# EAGLE design VotronicSRDuoDig_connector (EAGLE 7.6.0)
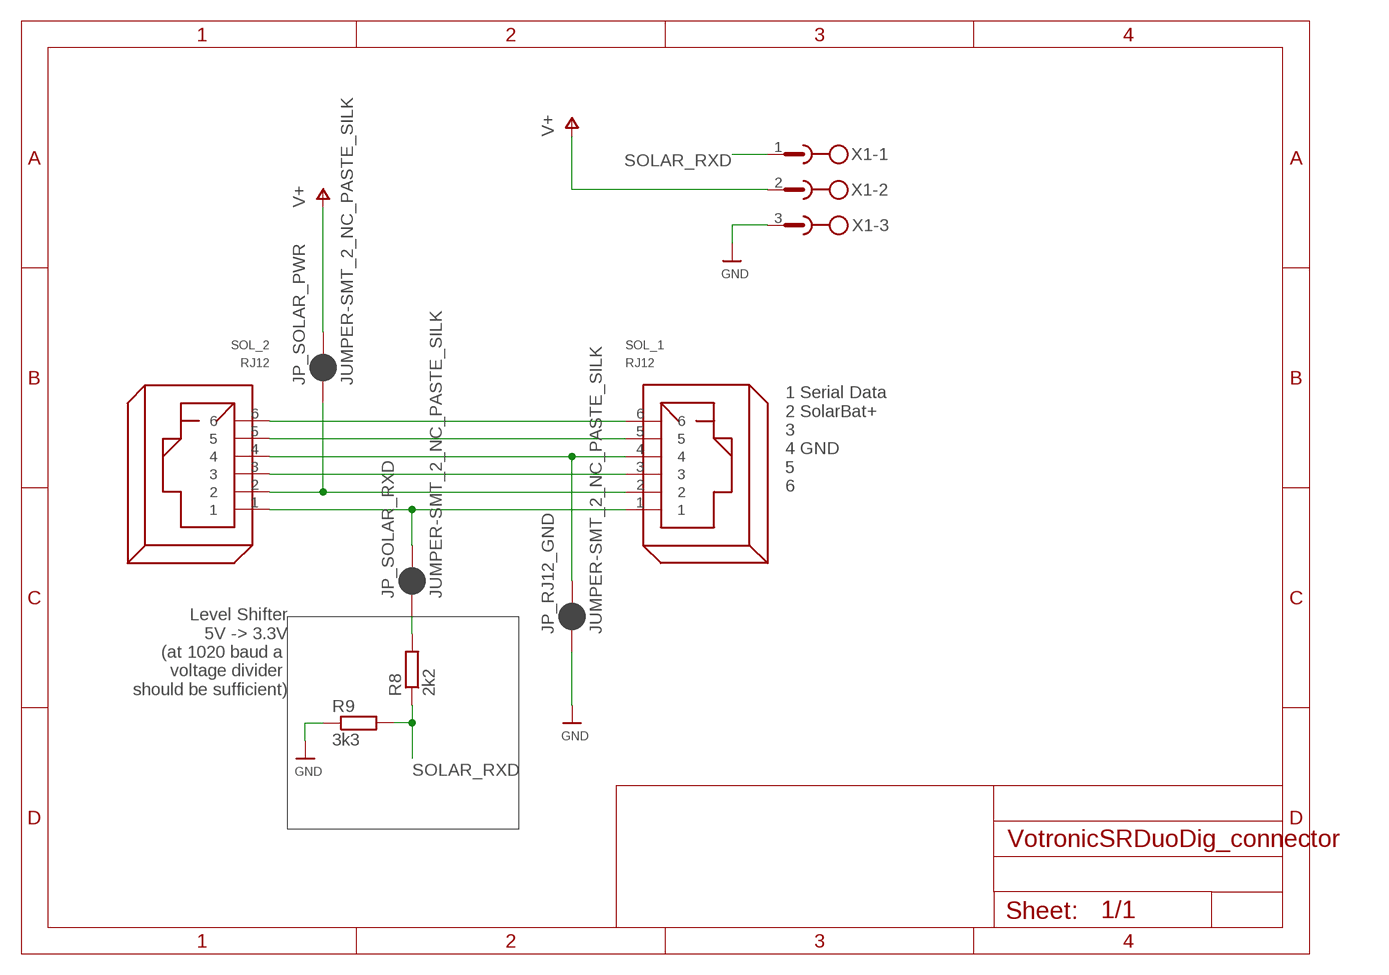
[diagram p0: schematic, sheet 1]

## Parts
JP_RJ12_GND  JUMPER-SMT_2_NC_PASTE_SILK  [SMT-JUMPER_2_NC_PASTE_SILK]
JP_SOLAR_PWR  JUMPER-SMT_2_NC_PASTE_SILK  [SMT-JUMPER_2_NC_PASTE_SILK]
JP_SOLAR_RXD  JUMPER-SMT_2_NC_PASTE_SILK  [SMT-JUMPER_2_NC_PASTE_SILK]
R8  2k2  R-EU_R0805  [R0805]
R9  3k3  R-EU_R0805  [R0805]
SOL_1  RJ12  [RJ12]
SOL_2  RJ12  [RJ12]
X1  W232-3  [W232-3]

## Nets
GND [power]: JP_RJ12_GND.1 R9.1 X1.3
N$1: JP_SOLAR_RXD.1 R8.2
N$2: SOL_1.3 SOL_2.3
N$3 [power]: JP_SOLAR_PWR.1 SOL_1.2 SOL_2.2
N$4: JP_SOLAR_RXD.2 SOL_1.1 SOL_2.1
N$5: SOL_1.5 SOL_2.5
N$6: SOL_1.6 SOL_2.6
SOLAR_GND [power]: JP_RJ12_GND.2 SOL_1.4 SOL_2.4
SOLAR_RXD: R8.1 R9.2 X1.1
V+ [power]: JP_SOLAR_PWR.2 X1.2

## Notes on the sheet
- 1 Serial Data
  2 SolarBat+
  3
  4 GND
  5 
  6
- Level Shifter
  5V -> 3.3V
  (at 1020 baud a 
  voltage divider 
  should be sufficient)

## Library data of the parts
JP_RJ12_GND JP_SOLAR_PWR JP_SOLAR_RXD = SparkFun-Jumpers:JUMPER-SMT_2_NC_PASTE: Normally closed solder jumper This jumper has an aperture in the stencil to allow solder paste to bridge the split in the wire so it's normally closed (NC). Wick off the solder to open the connection. Reapply solder to reclose the connection.
R8 R9 = rcl:R-EU_: RESISTOR, European symbol
SOL_1 SOL_2 = con-rj:RJ12: RJ12, RJ14 and RJ25 RJ12, RJ14 and RJ25 jacks side mounted http://www.tycoelectronics.com
X1 = con-wago-508:W232-3: WAGO SREW CLAMP; OC_FARNELL: unknown; OC_NEWARK: unknown

## Net classes
1 power: width 0.508 mm, clearance 0.102 mm

## Board
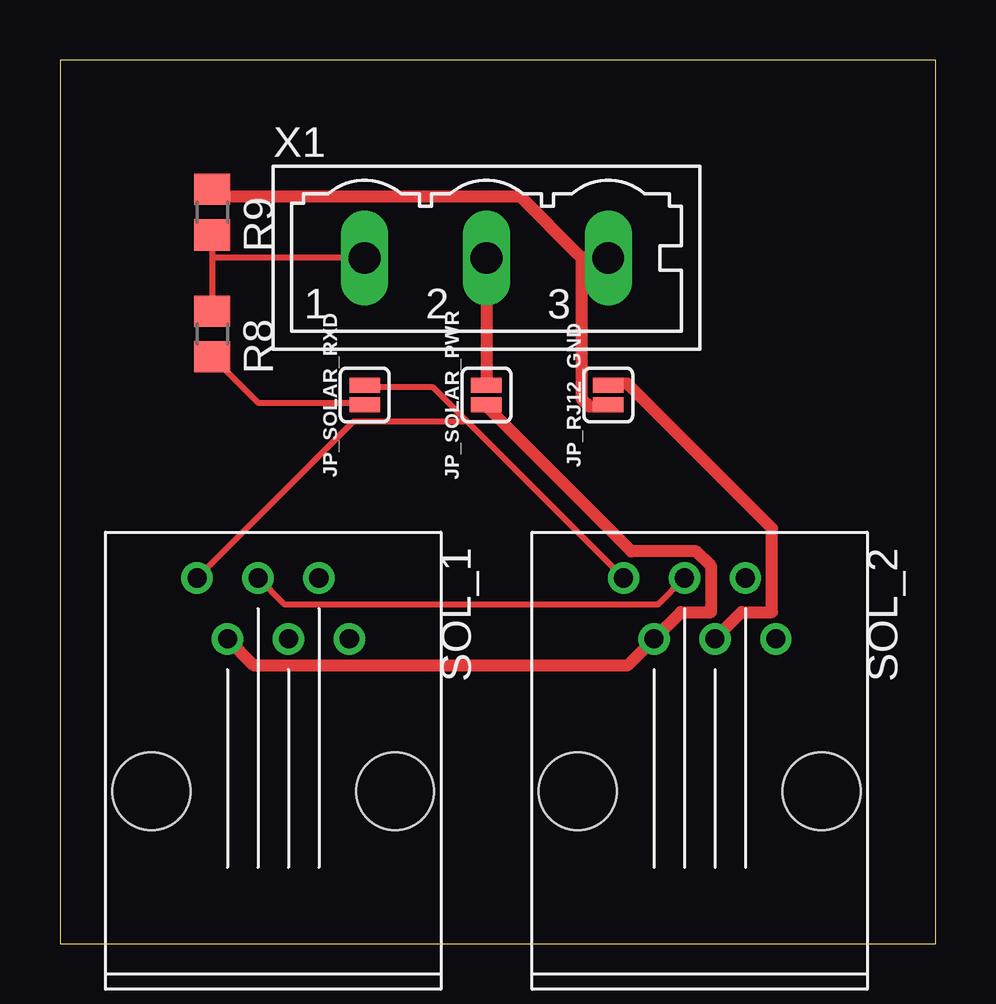
[diagram p1: board, top side]
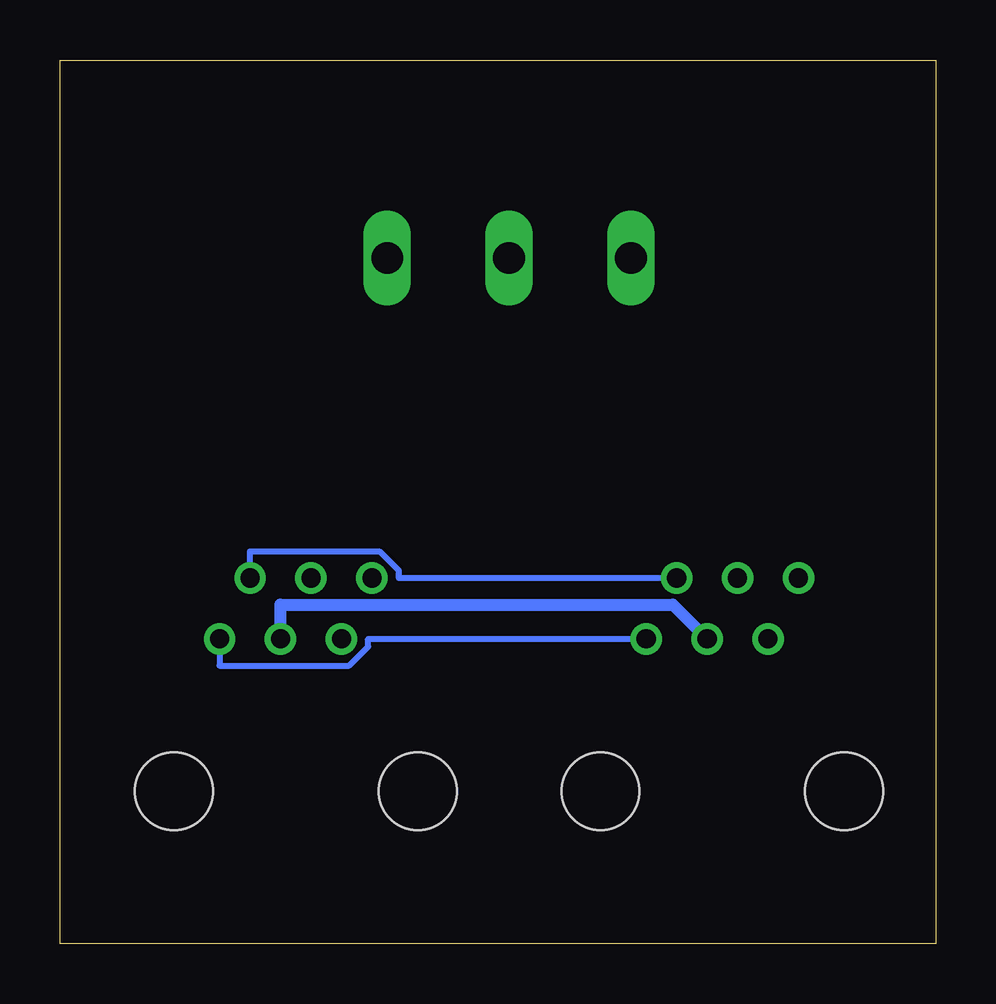
[diagram p2: board, bottom side, seen from below]

Size 36.5 x 36.82 mm. Coordinates in mm from the lower left corner, seen from the top.
Outline: 0,0 36.5,0 36.5,36.82 0,36.82 0,0
Copper layers (1*16): Top 0.035mm / dielectric 1.5mm / Bottom 0.035mm
Design rules "default": minimum track width 10mil, minimum drill 24mil, track to track 8mil, track to pad 8mil, pad to pad 8mil, via to via 8mil, smd to smd 8mil, copper to edge 40mil, drill to drill 8mil, minimum pad ring 10mil, minimum via ring 8mil, stop-mask expansion 4mil, vias tented up to drill 0mil, thermal gap 10mil

### Footprints (pad centres in the part's own frame; a part is rotated, then mirrored left to right if it is on the bottom)
SMT-JUMPER_2_NC_PASTE_SILK = smd 0.635 x 1.27: 1 -0.406,0; 2 0.406,0
R0805 = smd 1.3 x 1.5: 1 -0.95,0; 2 0.95,0
RJ12 = drill 0.8: 1 -8.89,-3.175; 2 -6.35,-1.905; 3 -8.89,-0.635; 4 -6.35,0.635; 5 -8.89,1.905; 6 -6.35,3.175 | hole 3.25: 0,-5.08; 0,5.08
W232-3 = drill 1.321 long: 1 -5.08,-0.635; 2 0,-0.635; 3 5.08,-0.635

### Placement (x,y rotation side)
JP_RJ12_GND  22.86,22.86 90 top
JP_SOLAR_PWR  17.78,22.86 90 top
JP_SOLAR_RXD  12.7,22.86 90 top
R8  6.35,25.4 270 top
R9  6.35,30.48 270 top
SOL_1  8.89,6.35 270 top
SOL_2  26.67,6.35 270 top
X1  17.78,29.21 0 top

### Tracks (layer width: path | path; a pad name or v marks a point on that pad's centre or on a via)
GND
  Top 0.508: 21.75,28.57 21.75,22.7 22.07,22.38 22.86,22.38 JP_RJ12_GND.1 | X1.3 21.75,28.57 | R9.1 6.35,31.27 6.51,31.11 19.21,31.11 21.59,28.73 21.75,28.57
N$1
  Top 0.254: JP_SOLAR_RXD.1 12.7,22.54 8.26,22.54 R8.2
N$2
  Top 0.254: SOL_1.3 9.37,14.13 24.92,14.13 SOL_2.3
N$3
  Top 0.508: JP_SOLAR_PWR.1 17.78,22.38 23.81,16.35 26.51,16.35 27.15,15.72 27.15,13.81 25.88,13.81 SOL_2.2 24.61,12.54 23.65,11.59 8.1,11.59 SOL_1.2
N$4
  Top 0.254: SOL_2.1 16.91,21.83 | 16.91,21.83 15.56,23.18 12.7,23.18 JP_SOLAR_RXD.2 | SOL_1.1 12.22,21.75 16.83,21.75 16.91,21.83
N$5
  Bottom 0.254: SOL_1.5 22.38,15.24 22.38,15.56 23.18,16.35 28.57,16.35 SOL_2.5
N$6
  Bottom 0.254: SOL_1.6 23.65,12.7 23.65,12.38 24.45,11.59 29.84,11.59 SOL_2.6
SOLAR_GND
  Top 0.508: SOL_2.4 28.42,13.81 29.69,13.81 29.69,17.3 23.65,23.34 22.86,23.34 JP_RJ12_GND.2
  Bottom 0.508: SOL_1.4 10.95,14.13 27.3,14.13 SOL_2.4
SOLAR_RXD
  Top 0.254: 6.35,28.57 R9.2 | 6.35,28.57 R8.1 | X1.1 6.35,28.57
V+
  Top 0.508: X1.2 17.78,23.34 JP_SOLAR_PWR.2